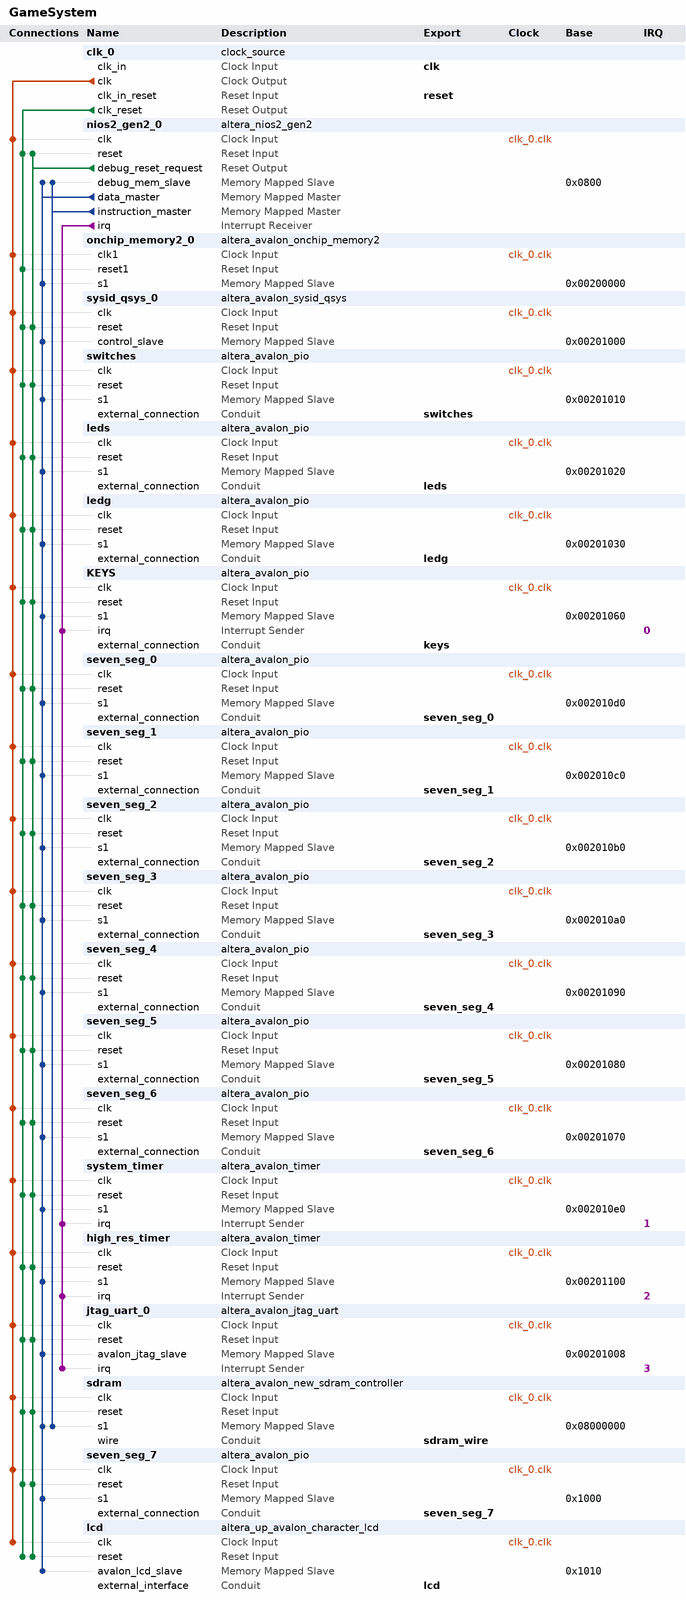
[diagram p0: system contents]
# Platform Designer (Qsys) system GameSystem, Cyclone IV E EP4CE115F29C7
# Parameters at their usual value, and those the tool derives, are not listed.
package require -exact qsys 16.1
create_system GameSystem
set_project_property DEVICE_FAMILY {Cyclone IV E}
set_project_property DEVICE EP4CE115F29C7

add_instance clk_0 clock_source 16.1
set_instance_parameter_value clk_0 clockFrequency 50000000

add_instance nios2_gen2_0 altera_nios2_gen2 16.1
set_instance_parameter_value nios2_gen2_0 dcache_size 2048
set_instance_parameter_value nios2_gen2_0 exceptionSlave sdram.s1
set_instance_parameter_value nios2_gen2_0 icache_size 4096
set_instance_parameter_value nios2_gen2_0 impl Fast
set_instance_parameter_value nios2_gen2_0 resetSlave sdram.s1

add_instance onchip_memory2_0 altera_avalon_onchip_memory2 16.1
set_instance_parameter_value onchip_memory2_0 dataWidth 32
set_instance_parameter_value onchip_memory2_0 dualPort false
set_instance_parameter_value onchip_memory2_0 initMemContent true
set_instance_parameter_value onchip_memory2_0 initializationFileName onchip_mem.hex
set_instance_parameter_value onchip_memory2_0 memorySize 4096

add_instance sysid_qsys_0 altera_avalon_sysid_qsys 16.1
set_instance_parameter_value sysid_qsys_0 id 16843008

add_instance switches altera_avalon_pio 16.1
set_instance_parameter_value switches direction Input
set_instance_parameter_value switches width 18

add_instance leds altera_avalon_pio 16.1
set_instance_parameter_value leds direction Output
set_instance_parameter_value leds width 18

add_instance ledg altera_avalon_pio 16.1
set_instance_parameter_value ledg direction Output
set_instance_parameter_value ledg width 8

add_instance KEYS altera_avalon_pio 16.1
set_instance_parameter_value KEYS captureEdge true
set_instance_parameter_value KEYS direction Input
set_instance_parameter_value KEYS edgeType FALLING
set_instance_parameter_value KEYS generateIRQ true
set_instance_parameter_value KEYS irqType EDGE
set_instance_parameter_value KEYS width 3

add_instance seven_seg_0 altera_avalon_pio 16.1
set_instance_parameter_value seven_seg_0 direction Output
set_instance_parameter_value seven_seg_0 width 7

add_instance seven_seg_1 altera_avalon_pio 16.1
set_instance_parameter_value seven_seg_1 direction Output
set_instance_parameter_value seven_seg_1 width 7

add_instance seven_seg_2 altera_avalon_pio 16.1
set_instance_parameter_value seven_seg_2 direction Output
set_instance_parameter_value seven_seg_2 width 7

add_instance seven_seg_3 altera_avalon_pio 16.1
set_instance_parameter_value seven_seg_3 direction Output
set_instance_parameter_value seven_seg_3 width 7

add_instance seven_seg_4 altera_avalon_pio 16.1
set_instance_parameter_value seven_seg_4 direction Output
set_instance_parameter_value seven_seg_4 width 7

add_instance seven_seg_5 altera_avalon_pio 16.1
set_instance_parameter_value seven_seg_5 direction Output
set_instance_parameter_value seven_seg_5 width 7

add_instance seven_seg_6 altera_avalon_pio 16.1
set_instance_parameter_value seven_seg_6 direction Output
set_instance_parameter_value seven_seg_6 width 7

add_instance system_timer altera_avalon_timer 16.1
set_instance_parameter_value system_timer period 1
set_instance_parameter_value system_timer periodUnits MSEC

add_instance high_res_timer altera_avalon_timer 16.1
set_instance_parameter_value high_res_timer period 1
set_instance_parameter_value high_res_timer periodUnits USEC

add_instance jtag_uart_0 altera_avalon_jtag_uart 16.1
set_instance_parameter_value jtag_uart_0 simInteractiveOptions NO_INTERACTIVE_WINDOWS

add_instance sdram altera_avalon_new_sdram_controller 16.1
set_instance_parameter_value sdram TAC 5.4
set_instance_parameter_value sdram TRCD 15.0
set_instance_parameter_value sdram TRP 15.0
set_instance_parameter_value sdram casLatency 3
set_instance_parameter_value sdram columnWidth 10
set_instance_parameter_value sdram dataWidth 32
set_instance_parameter_value sdram generateSimulationModel false
set_instance_parameter_value sdram model single_Micron_MT48LC4M32B2_7_chip
set_instance_parameter_value sdram numberOfBanks 4
set_instance_parameter_value sdram numberOfChipSelects 1
set_instance_parameter_value sdram powerUpDelay 100.0
set_instance_parameter_value sdram refreshPeriod 7.8125
set_instance_parameter_value sdram rowWidth 13

add_instance seven_seg_7 altera_avalon_pio 16.1
set_instance_parameter_value seven_seg_7 direction Output
set_instance_parameter_value seven_seg_7 width 7

add_instance lcd altera_up_avalon_character_lcd 16.1
set_instance_parameter_value lcd cursor Normal

# connections
add_connection clk_0.clk high_res_timer.clk clock
add_connection clk_0.clk jtag_uart_0.clk clock
add_connection clk_0.clk KEYS.clk clock
add_connection clk_0.clk lcd.clk clock
add_connection clk_0.clk ledg.clk clock
add_connection clk_0.clk leds.clk clock
add_connection clk_0.clk nios2_gen2_0.clk clock
add_connection clk_0.clk onchip_memory2_0.clk1 clock
add_connection clk_0.clk sdram.clk clock
add_connection clk_0.clk seven_seg_0.clk clock
add_connection clk_0.clk seven_seg_1.clk clock
add_connection clk_0.clk seven_seg_2.clk clock
add_connection clk_0.clk seven_seg_3.clk clock
add_connection clk_0.clk seven_seg_4.clk clock
add_connection clk_0.clk seven_seg_5.clk clock
add_connection clk_0.clk seven_seg_6.clk clock
add_connection clk_0.clk seven_seg_7.clk clock
add_connection clk_0.clk switches.clk clock
add_connection clk_0.clk sysid_qsys_0.clk clock
add_connection clk_0.clk system_timer.clk clock
add_connection clk_0.clk_reset high_res_timer.reset reset
add_connection clk_0.clk_reset jtag_uart_0.reset reset
add_connection clk_0.clk_reset KEYS.reset reset
add_connection clk_0.clk_reset lcd.reset reset
add_connection clk_0.clk_reset ledg.reset reset
add_connection clk_0.clk_reset leds.reset reset
add_connection clk_0.clk_reset nios2_gen2_0.reset reset
add_connection clk_0.clk_reset onchip_memory2_0.reset1 reset
add_connection clk_0.clk_reset sdram.reset reset
add_connection clk_0.clk_reset seven_seg_0.reset reset
add_connection clk_0.clk_reset seven_seg_1.reset reset
add_connection clk_0.clk_reset seven_seg_2.reset reset
add_connection clk_0.clk_reset seven_seg_3.reset reset
add_connection clk_0.clk_reset seven_seg_4.reset reset
add_connection clk_0.clk_reset seven_seg_5.reset reset
add_connection clk_0.clk_reset seven_seg_6.reset reset
add_connection clk_0.clk_reset seven_seg_7.reset reset
add_connection clk_0.clk_reset switches.reset reset
add_connection clk_0.clk_reset sysid_qsys_0.reset reset
add_connection clk_0.clk_reset system_timer.reset reset
add_connection nios2_gen2_0.debug_reset_request high_res_timer.reset reset
add_connection nios2_gen2_0.debug_reset_request jtag_uart_0.reset reset
add_connection nios2_gen2_0.debug_reset_request KEYS.reset reset
add_connection nios2_gen2_0.debug_reset_request lcd.reset reset
add_connection nios2_gen2_0.debug_reset_request ledg.reset reset
add_connection nios2_gen2_0.debug_reset_request leds.reset reset
add_connection nios2_gen2_0.debug_reset_request nios2_gen2_0.reset reset
add_connection nios2_gen2_0.debug_reset_request sdram.reset reset
add_connection nios2_gen2_0.debug_reset_request seven_seg_0.reset reset
add_connection nios2_gen2_0.debug_reset_request seven_seg_1.reset reset
add_connection nios2_gen2_0.debug_reset_request seven_seg_2.reset reset
add_connection nios2_gen2_0.debug_reset_request seven_seg_3.reset reset
add_connection nios2_gen2_0.debug_reset_request seven_seg_4.reset reset
add_connection nios2_gen2_0.debug_reset_request seven_seg_5.reset reset
add_connection nios2_gen2_0.debug_reset_request seven_seg_6.reset reset
add_connection nios2_gen2_0.debug_reset_request seven_seg_7.reset reset
add_connection nios2_gen2_0.debug_reset_request switches.reset reset
add_connection nios2_gen2_0.debug_reset_request sysid_qsys_0.reset reset
add_connection nios2_gen2_0.debug_reset_request system_timer.reset reset
add_connection nios2_gen2_0.data_master high_res_timer.s1 avalon
set_connection_parameter_value nios2_gen2_0.data_master/high_res_timer.s1 baseAddress 0x00201100
add_connection nios2_gen2_0.data_master jtag_uart_0.avalon_jtag_slave avalon
set_connection_parameter_value nios2_gen2_0.data_master/jtag_uart_0.avalon_jtag_slave baseAddress 0x00201008
add_connection nios2_gen2_0.data_master KEYS.s1 avalon
set_connection_parameter_value nios2_gen2_0.data_master/KEYS.s1 baseAddress 0x00201060
add_connection nios2_gen2_0.data_master lcd.avalon_lcd_slave avalon
set_connection_parameter_value nios2_gen2_0.data_master/lcd.avalon_lcd_slave baseAddress 0x1010
add_connection nios2_gen2_0.data_master ledg.s1 avalon
set_connection_parameter_value nios2_gen2_0.data_master/ledg.s1 baseAddress 0x00201030
add_connection nios2_gen2_0.data_master leds.s1 avalon
set_connection_parameter_value nios2_gen2_0.data_master/leds.s1 baseAddress 0x00201020
add_connection nios2_gen2_0.data_master nios2_gen2_0.debug_mem_slave avalon
set_connection_parameter_value nios2_gen2_0.data_master/nios2_gen2_0.debug_mem_slave baseAddress 0x0800
add_connection nios2_gen2_0.data_master onchip_memory2_0.s1 avalon
set_connection_parameter_value nios2_gen2_0.data_master/onchip_memory2_0.s1 baseAddress 0x00200000
add_connection nios2_gen2_0.data_master sdram.s1 avalon
set_connection_parameter_value nios2_gen2_0.data_master/sdram.s1 baseAddress 0x08000000
add_connection nios2_gen2_0.data_master seven_seg_0.s1 avalon
set_connection_parameter_value nios2_gen2_0.data_master/seven_seg_0.s1 baseAddress 0x002010d0
add_connection nios2_gen2_0.data_master seven_seg_1.s1 avalon
set_connection_parameter_value nios2_gen2_0.data_master/seven_seg_1.s1 baseAddress 0x002010c0
add_connection nios2_gen2_0.data_master seven_seg_2.s1 avalon
set_connection_parameter_value nios2_gen2_0.data_master/seven_seg_2.s1 baseAddress 0x002010b0
add_connection nios2_gen2_0.data_master seven_seg_3.s1 avalon
set_connection_parameter_value nios2_gen2_0.data_master/seven_seg_3.s1 baseAddress 0x002010a0
add_connection nios2_gen2_0.data_master seven_seg_4.s1 avalon
set_connection_parameter_value nios2_gen2_0.data_master/seven_seg_4.s1 baseAddress 0x00201090
add_connection nios2_gen2_0.data_master seven_seg_5.s1 avalon
set_connection_parameter_value nios2_gen2_0.data_master/seven_seg_5.s1 baseAddress 0x00201080
add_connection nios2_gen2_0.data_master seven_seg_6.s1 avalon
set_connection_parameter_value nios2_gen2_0.data_master/seven_seg_6.s1 baseAddress 0x00201070
add_connection nios2_gen2_0.data_master seven_seg_7.s1 avalon
set_connection_parameter_value nios2_gen2_0.data_master/seven_seg_7.s1 baseAddress 0x1000
add_connection nios2_gen2_0.data_master switches.s1 avalon
set_connection_parameter_value nios2_gen2_0.data_master/switches.s1 baseAddress 0x00201010
add_connection nios2_gen2_0.data_master sysid_qsys_0.control_slave avalon
set_connection_parameter_value nios2_gen2_0.data_master/sysid_qsys_0.control_slave baseAddress 0x00201000
add_connection nios2_gen2_0.data_master system_timer.s1 avalon
set_connection_parameter_value nios2_gen2_0.data_master/system_timer.s1 baseAddress 0x002010e0
add_connection nios2_gen2_0.instruction_master nios2_gen2_0.debug_mem_slave avalon
set_connection_parameter_value nios2_gen2_0.instruction_master/nios2_gen2_0.debug_mem_slave baseAddress 0x0800
add_connection nios2_gen2_0.instruction_master sdram.s1 avalon
set_connection_parameter_value nios2_gen2_0.instruction_master/sdram.s1 baseAddress 0x08000000
add_connection nios2_gen2_0.irq high_res_timer.irq interrupt
set_connection_parameter_value nios2_gen2_0.irq/high_res_timer.irq irqNumber 2
add_connection nios2_gen2_0.irq jtag_uart_0.irq interrupt
set_connection_parameter_value nios2_gen2_0.irq/jtag_uart_0.irq irqNumber 3
add_connection nios2_gen2_0.irq KEYS.irq interrupt
set_connection_parameter_value nios2_gen2_0.irq/KEYS.irq irqNumber 0
add_connection nios2_gen2_0.irq system_timer.irq interrupt
set_connection_parameter_value nios2_gen2_0.irq/system_timer.irq irqNumber 1

# exported interfaces
add_interface clk clock sink
set_interface_property clk EXPORT_OF clk_0.clk_in
add_interface keys conduit end
set_interface_property keys EXPORT_OF KEYS.external_connection
add_interface lcd conduit end
set_interface_property lcd EXPORT_OF lcd.external_interface
add_interface ledg conduit end
set_interface_property ledg EXPORT_OF ledg.external_connection
add_interface leds conduit end
set_interface_property leds EXPORT_OF leds.external_connection
add_interface reset reset sink
set_interface_property reset EXPORT_OF clk_0.clk_in_reset
add_interface sdram_wire conduit end
set_interface_property sdram_wire EXPORT_OF sdram.wire
add_interface seven_seg_0 conduit end
set_interface_property seven_seg_0 EXPORT_OF seven_seg_0.external_connection
add_interface seven_seg_1 conduit end
set_interface_property seven_seg_1 EXPORT_OF seven_seg_1.external_connection
add_interface seven_seg_2 conduit end
set_interface_property seven_seg_2 EXPORT_OF seven_seg_2.external_connection
add_interface seven_seg_3 conduit end
set_interface_property seven_seg_3 EXPORT_OF seven_seg_3.external_connection
add_interface seven_seg_4 conduit end
set_interface_property seven_seg_4 EXPORT_OF seven_seg_4.external_connection
add_interface seven_seg_5 conduit end
set_interface_property seven_seg_5 EXPORT_OF seven_seg_5.external_connection
add_interface seven_seg_6 conduit end
set_interface_property seven_seg_6 EXPORT_OF seven_seg_6.external_connection
add_interface seven_seg_7 conduit end
set_interface_property seven_seg_7 EXPORT_OF seven_seg_7.external_connection
add_interface switches conduit end
set_interface_property switches EXPORT_OF switches.external_connection

set_interconnect_requirement {$system} qsys_mm.clockCrossingAdapter HANDSHAKE
set_interconnect_requirement {$system} qsys_mm.enableEccProtection FALSE
set_interconnect_requirement {$system} qsys_mm.insertDefaultSlave FALSE
set_interconnect_requirement {$system} qsys_mm.maxAdditionalLatency 1

save_system GameSystem.qsys
